# Altium schematic sheet 1TS003B-1400-3500A1_1TS003B-1400-3500A.schdoc
size 127 x 99 mm
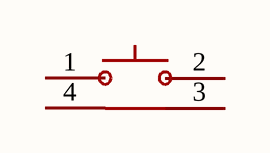
[diagram p0: 1TS003B-1400-3500A1_1TS003B-1400-3500A.schdoc]

## Parts
SW?  1TS003B-1400-3500A-CT  [KEY-SMD_1TS003B]  (value not drawn)

## Nets

Not connected (* = marked no-connect by the designer): SW? 1 2 3 4

## Library data of the parts
SW? = 1TS003B-1400-3500A-CT: Manufacturer: HYP(鸿源精密); Add into BOM: yes; Circuit: SPST; Actuator Style: Rectangular Button; Operating Force: 1.4N; Switch Height: 3.5mm; with Bracket: Without Bracket; Contact Current: 50mA; Voltage Rating: 12V; Actuator/Cap Color: Black; With Lamp: No; Life: 50,000 Cycles; Symbol: 1TS003B-1400-3500A; Device: 1TS003B-1400-3500A-CT; LCSC Part Name: 4.6*1.82*3.5mm 卧贴 轻触开关; Supplier Part: C319392; Manufacturer Part: 1TS003B-1400-3500A-CT; Supplier Footprint: SMD,1.8x4.6mm; JLCPCB Part Class: Extended Part; Datasheet: https://item.szlcsc.com/datasheet/1TS003B-1400-3500A-CT/300391.html; Supplier: LCSC; Convert to PCB: yes; Mounting Type: Surface Mount, Right Angle; Length: 4.6mm; Width: 1.82mm; Termination Style: J-Lead; Operating Temperature: -40℃~+90℃